# Altium schematic sheet On Board Terminals.SchDoc
size 297 x 209 mm; SheetNumber: 28; SheetTotal: 29
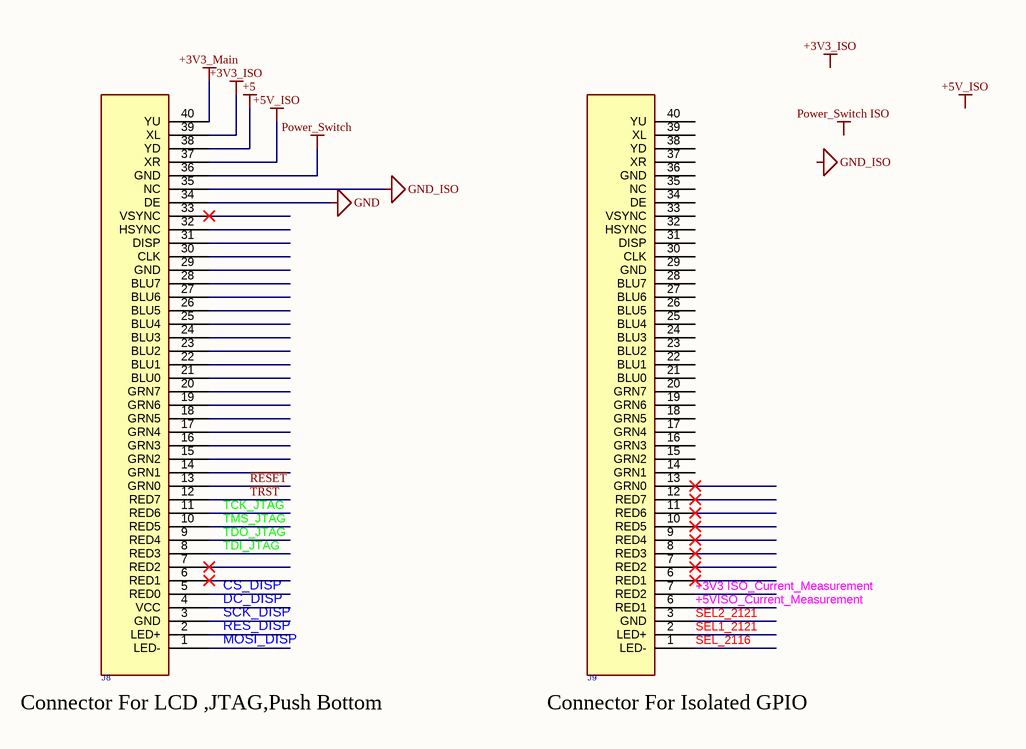
[diagram p0: On Board Terminals.SchDoc]

## Parts
J8  FPC50 40  [FPC50_40]  (value not drawn)
J9  FPC50 40  [FPC50_40]  (value not drawn)

## Nets
+3V3_ISO: J8.39(XL)
+3V3_Main: J8.40(YU)
+5: J8.38(YD)
+5V_ISO: J8.37(XR)
GND: J8.34(DE)
GND_ISO: J8.35(NC)
Power_Switch: J8.36(GND)
+3V3 ISO_Current_Measurement: J9.7(RED2)
+5VISO_Current_Measurement: J9.6(RED1)
CS_DISP: J8.5(RED0)
DC_DISP: J8.4(VCC)
MOSI_DISP: J8.1(LED-)
~{RESET}: J8.13(GRN0)
RES_DISP: J8.2(LED+)
SCK_DISP: J8.3(GND)
SEL1_2121: J9.2(LED+)
SEL2_2121: J9.3(GND)
SEL_2116: J9.1(LED-)
~{TRST}: J8.12(RED7)
TCK_JTAG: J8.11(RED6)
TDI_JTAG: J8.8(RED3)
TDO_JTAG: J8.9(RED4)
TMS_JTAG: J8.10(RED5)

Not connected (* = marked no-connect by the designer): J8 6(RED1)* 7(RED2)* 14(GRN1) 15(GRN2) 16(GRN3) 17(GRN4) 18(GRN5) 19(GRN6) 20(GRN7) 21(BLU0) 22(BLU1) 23(BLU2) 24(BLU3) 25(BLU4) 26(BLU5) 27(BLU6) 28(BLU7) 29(GND) 30(CLK) 31(DISP) 32(HSYNC) 33(VSYNC)*; J9 8(RED3)* 9(RED4)* 10(RED5)* 11(RED6)* 12(RED7)* 13(GRN0)* 14(GRN1) 15(GRN2) 16(GRN3) 17(GRN4) 18(GRN5) 19(GRN6) 20(GRN7) 21(BLU0) 22(BLU1) 23(BLU2) 24(BLU3) 25(BLU4) 26(BLU5) 27(BLU6) 28(BLU7) 29(GND) 30(CLK) 31(DISP) 32(HSYNC) 33(VSYNC) 34(DE) 35(NC) 36(GND) 37(XR) 38(YD) 39(XL) 40(YU)

## Notes on the sheet
- (near J8) Connector For LCD ,JTAG,Push Bottom
- (near J9) Connector For Isolated GPIO
- Labels drawn without touching a wire or pin: +3V3_ISO, +5V_ISO, GND_ISO, Power_Switch ISO
- Drawn
- Name
- Date
- Drawing Title
- Checked
- Drawing No.
- Approved
- Size
- A4
- Ver.
- Rev.
- Sheet
- Of

## Library data of the parts
J8 J9 = FPC50 40: CONN, FPC, 0.50mm pitch, RightAngle, Bot. Contact; ComponentLink1Description: Website Smart World; ComponentLink1URL: https://www.smartw.ir/; ComponentLink2Description: Telegram; ComponentLink2URL: https://t.me/altium_smartw; ComponentLink3Description: Instagram; ComponentLink3URL: https://Instagram.com/smartgw.ir; DatasheetVersion: 2021